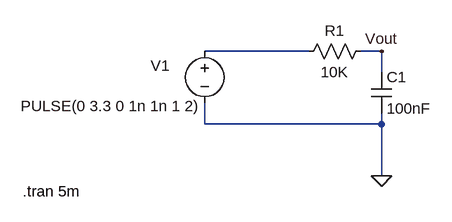
[diagram p0: schematic RC_TimeConstantForADC.asc]
RC_TimeConstantForADC.asc, the LTspice schematic file:
Version 4.1
SHEET 1 880 680
WIRE 112 128 -48 128
WIRE 224 128 192 128
WIRE 224 160 224 128
WIRE -48 240 -48 208
WIRE 224 240 224 224
WIRE 224 240 -48 240
WIRE 224 320 224 240
FLAG 224 320 0
FLAG 224 128 Vout
SYMBOL res 208 112 R90
WINDOW 0 0 56 VBottom 2
WINDOW 3 32 56 VTop 2
SYMATTR InstName R1
SYMATTR Value 10K
SYMBOL cap 208 160 R0
SYMATTR InstName C1
SYMATTR Value 100nF
SYMATTR SpiceLine V=6
SYMBOL voltage -48 112 R0
WINDOW 0 -83 38 Left 2
WINDOW 3 -283 100 Left 2
WINDOW 123 0 0 Left 0
WINDOW 39 0 0 Left 0
SYMATTR InstName V1
SYMATTR Value PULSE(0 3.3 0 1n 1n 1 2)
TEXT -328 344 Left 2 !.tran 5m

The netlist it stands for:
* RC_TimeConstantForADC.asc
R1 Vout N001 10K
C1 Vout 0 100nF V=6
V1 N001 0 PULSE(0 3.3 0 1n 1n 1 2)
.tran 5m
.backanno
.end